# Altium schematic sheet Boost_Stage.SchDoc
size B
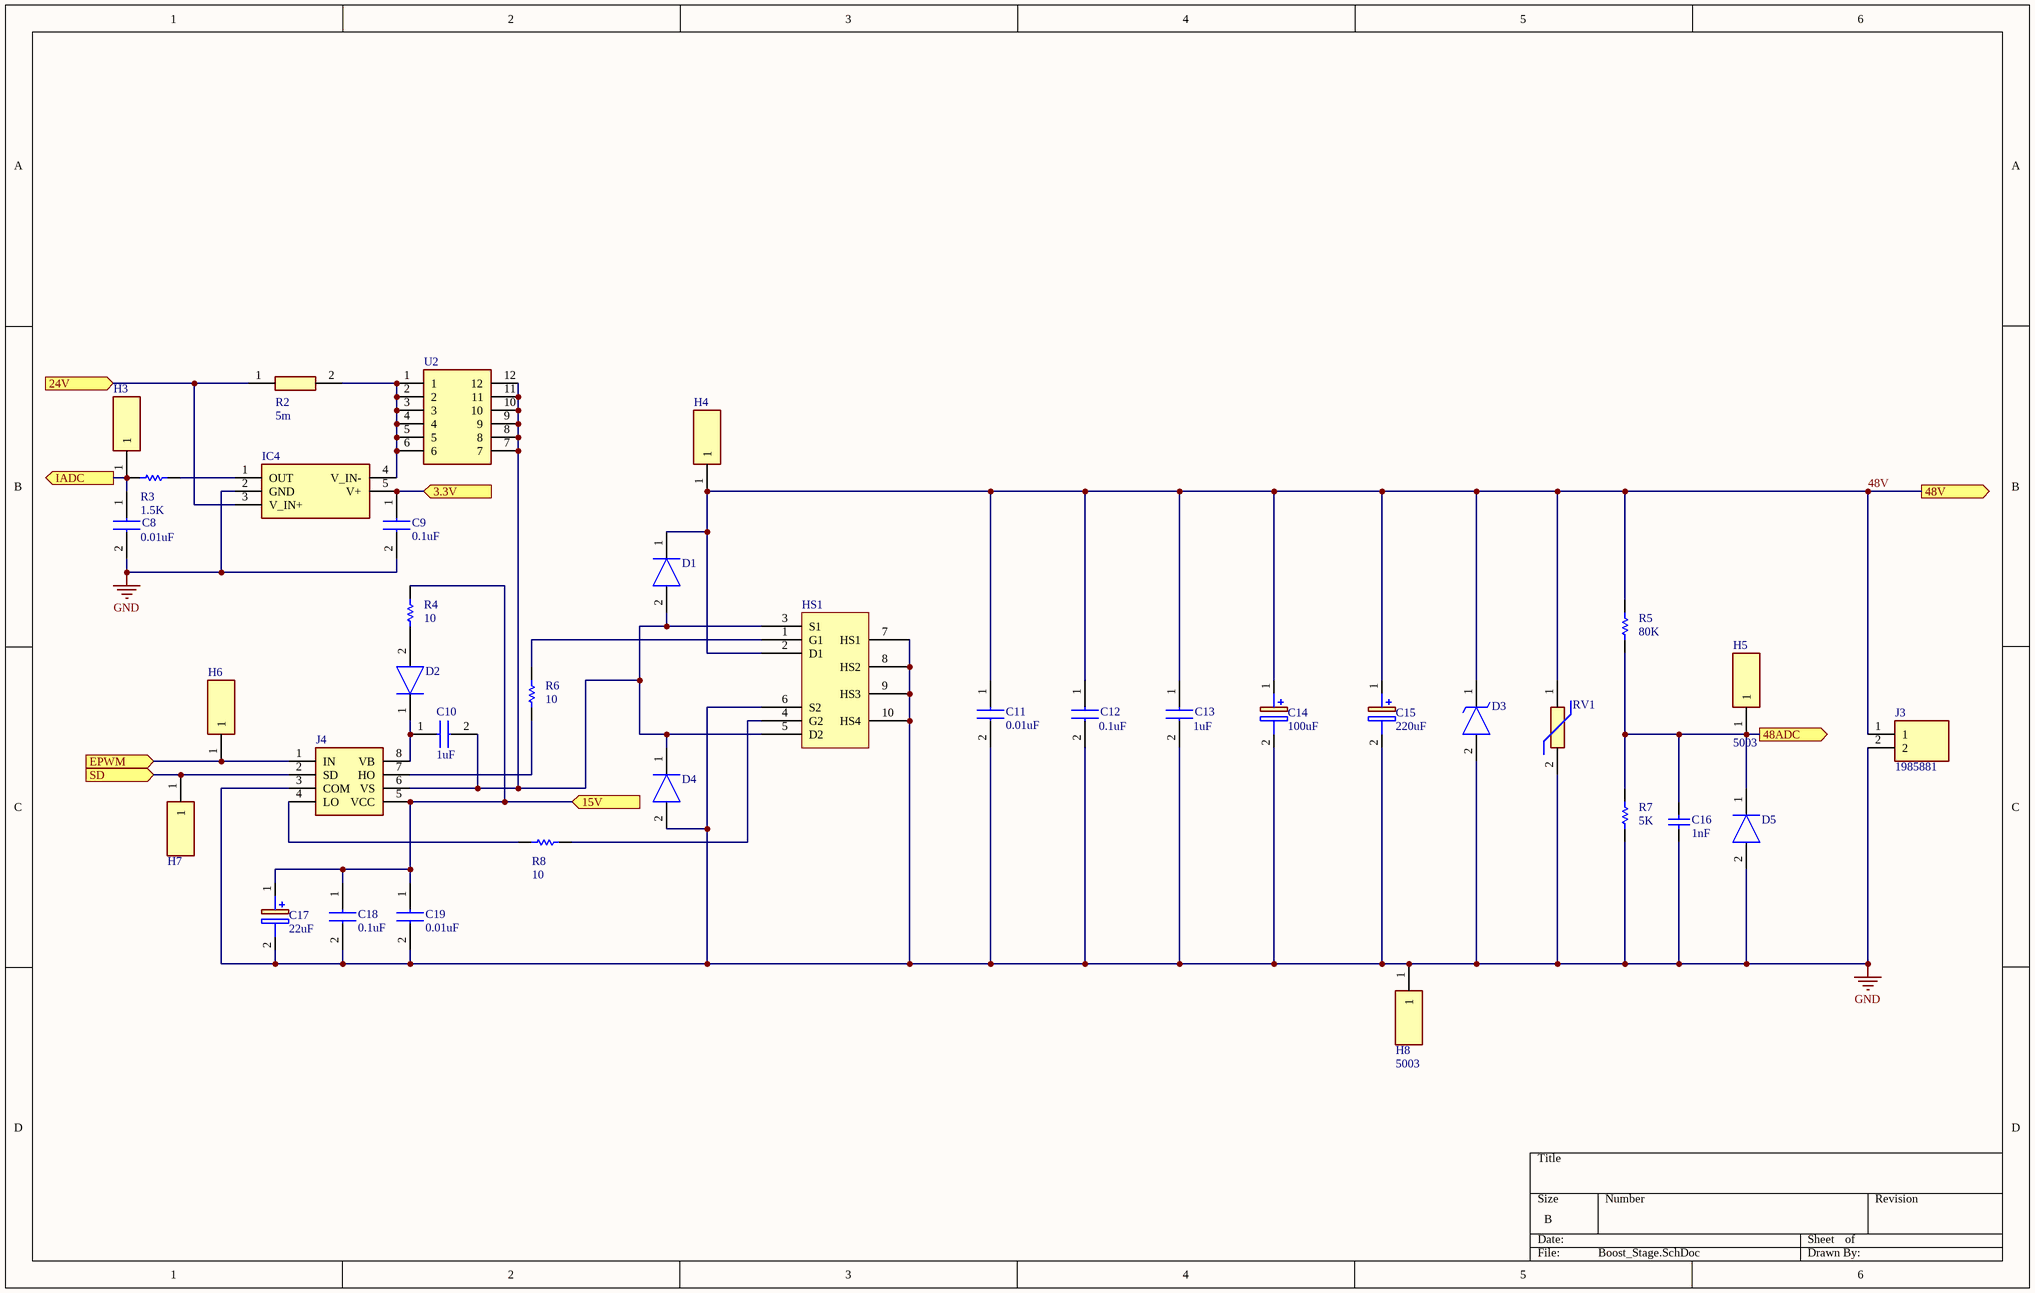
[diagram p0: Boost_Stage.SchDoc]

## Parts
C8  value 0.01uF  [C315C103K5R5TA7990]  (hidden comment: C315C103K5R5TA7990)
C9  value 0.1uF  [K104K10X7RF5UH5]  (hidden comment: K104K10X7RF5UH5)
C10  value 1uF  [RCE5C1H104J2A2H03B]  (hidden comment: RDER72A105K2M1H03A)
C11  value 0.01uF  [R82(7.2X2.5)]  (hidden comment: R82EC2100DQ50J)
C12  value 0.1uF  [ECQE2104JF]  (hidden comment: ECQ-E2104JF)
C13  value 1uF  [ECQE2105KF]  (hidden comment: ECQ-E2105KF)
C14  value 100uF  [CAPPRD500W65D1000H2200]  (hidden comment: EEU-FR2A101)
C15  value 220uF  [CAPPRD500W65D1250H2700]  (hidden comment: EEU-FS2A221)
C16  1nF  [CAPC2013X95X45NL10T25]
C17  value 22uF  [CAPPRD200W50D550H1250]  (hidden comment: UPW1E220MDD)
C18  value 0.1uF  [K104K10X7RF5UH5]  (hidden comment: K104K10X7RF5UH5)
C19  value 0.01uF  [C315C103K5R5TA7990]  (hidden comment: C315C103K5R5TA7990)
D1  S310FA  [SODFL3618X143N]  (value not drawn)
D2  1N4003  [DIOAD1413W86L463D238]  (value not drawn)
D3  P6KE91A-E3_54  [DIOAD1910W86L670D310]  (value not drawn)
D4  S310FA  [SODFL3618X143N]  (value not drawn)
D5  BZX584C3V3-G3-08  [SODFL1608X75N]  (value not drawn)
H3  5003  [5003]  (value not drawn)
H4  5003  [5003]  (value not drawn)
H5  5003  [5003]
H6  5003  [5003]  (value not drawn)
H7  5003  [5003]  (value not drawn)
H8  5003  [5003]
HS1  Dual Heatsink  [MOSFETsHeatsink]  (value not drawn)
IC4  INA194AIDBVR  [SOT95P280X145-5N]  (value not drawn)
J3  1985881  [SHDR2W110P0X500_1X2_1000X985X1390P]
J4  DILB8P-223TLF  [DIPS762W60P254L1016H525Q8N]  (value not drawn)
R2  5m  [CRE2512FZR005E3]
R3  value 1.5K  [AXIAL-0.3]  (hidden comment: Res1)
R4  value 10  [AXIAL-0.3]  (hidden comment: Res1)
R5  value 80K  [AXIAL-0.3]  (hidden comment: Res1)
R6  value 10  [AXIAL-0.3]  (hidden comment: Res1)
R7  value 5K  [AXIAL-0.3]  (hidden comment: Res1)
R8  value 10  [AXIAL-0.3]  (hidden comment: Res1)
RV1  V68ZS10P  [V68ZS10P]  (value not drawn)
U2  B65878E1012D001  [B65878E1012D001]  (value not drawn)

## Ports
3.3V (in), 15V (in), 24V (in), 48ADC (out), 48V (out), EPWM (in), IADC (out), SD (in)

## Nets
GND: C8.2 C9.2 C11.2 C12.2 C13.2 C14.2(-) C15.2(-) C16.1 C17.2(-) C18.2 C19.2 D3.2(A) D4.2(A) D5.2(A) H8.1 HS1.6(S2) HS1.7(HS1) HS1.8(HS2) HS1.9(HS3) HS1.10(HS4) IC4.2(GND) J3.2 J4.3(COM) R7.1 RV1.2
3.3V: C9.1 IC4.5(V+) ; port 3.3V
15V: C17.1(+) C18.1 C19.1 J4.5(VCC) R4.2 ; port 15V
24V: IC4.3(V_IN+) R2.1 ; port 24V
48ADC: C16.2 D5.1(K) H5.1 R5.1 R7.2 ; port 48ADC
48V: C11.1 C12.1 C13.1 C14.1(+) C15.1(+) D1.1(K) D3.1(K) H4.1 HS1.2(D1) J3.1 R5.2 RV1.1 ; port 48V
EPWM: H6.1 J4.1(IN) ; port EPWM
IADC: C8.1 H3.1 R3.2 ; port IADC
SD: H7.1 J4.2(SD) ; port SD
NetC10_1: C10.1 D2.1(K) J4.8(VB)
NetC10_2: C10.2 D1.2(A) D4.1(K) HS1.3(S1) HS1.5(D2) J4.6(VS) U2.7 U2.8 U2.9 U2.10 U2.11 U2.12
NetD2_2: D2.2(A) R4.1
NetHS1_1: HS1.1(G1) R6.2
NetHS1_4: HS1.4(G2) R8.1
NetIC4_1: IC4.1(OUT) R3.1
NetIC4_4: IC4.4(V_IN-) R2.2 U2.1 U2.2 U2.3 U2.4 U2.5 U2.6
NetJ4_4: J4.4(LO) R8.2
NetJ4_7: J4.7(HO) R6.1

## Library data of the parts
C8 C19 = C315C103K5R5TA7990: Capacitor 50V; Manufacturer_Name: Kemet; Datasheet Link: https://api.kemet.com/component-edge/download/datasheet/C315C103K5R5TA.pdf; Height: 4.66mm; Manufacturer_Part_Number: C315C103K5R5TA7990; Mouser Part Number: N/A; Mouser Price/Stock: https://www.mouser.com/Search/Refine.aspx?Keyword=N%2FA
C9 C18 = K104K10X7RF5UH5: Capacitor 50V; Manufacturer_Name: Vishay; Datasheet Link: https://www.vishay.com/docs/45171/kseries.pdf; Height: 6.2mm; Manufacturer_Part_Number: K104K10X7RF5UH5; Mouser Part Number: 594-K104K10X7RF5UH5; Mouser Price/Stock: https://www.mouser.com/Search/Refine.aspx?Keyword=594-K104K10X7RF5UH5
C10 = RDER72A105K2M1H03A: Capacitor; Manufacturer_Name: Murata Electronics; Datasheet Link: https://psearch.en.murata.com/capacitor/product/RDER72A105K2M1H03A.html; Height: 5.5mm; Manufacturer_Part_Number: RDER72A105K2M1H03A; Mouser Part Number: 81-RDER72A105K2M1H3A; Mouser Price/Stock: https://www.mouser.com/Search/Refine.aspx?Keyword=81-RDER72A105K2M1H3A; RS Part Number: 1504005; RS Price/Stock: http://uk.rs-online.com/web/p/products/1504005
C11 = R82EC2100DQ50J: Capacitor 100V; Manufacturer_Name: Kemet; Allied_Number: 70037796; Datasheet Link: http://docs-emea.rs-online.com/webdocs/1529/0900766b81529050.pdf; Manufacturer_Part_Number: R82EC2100DQ50J; Mouser Part Number: 80-R82EC2100DQ50J; Mouser Price/Stock: https://www.mouser.com/Search/Refine.aspx?Keyword=80-R82EC2100DQ50J; RS Part Number: 3121431P; RS Price/Stock: http://uk.rs-online.com/web/p/products/3121431P; Allied Price/Stock: https://www.alliedelec.com/kemet-r82ec2100dq50j/70037796/
C12 = ECQ-E2104JF: Capacitor 250V; Manufacturer_Name: Panasonic; Allied_Number: 70260012; Datasheet Link: http://industrial.panasonic.com/www-cgi/jvcr13pz.cgi?E+PZ+4+ABD0023+ECQE2104JF+8+WW; Height: 13.4mm; Manufacturer_Part_Number: ECQ-E2104JF; Mouser Part Number: 667-ECQ-E2104JF; Mouser Price/Stock: https://www.mouser.com/Search/Refine.aspx?Keyword=667-ECQ-E2104JF; Allied Price/Stock: https://www.alliedelec.com/panasonic-ecq-e2104jf/70260012/
C13 = ECQ-E2105KF: Capacitor 250V; Manufacturer_Name: Panasonic; Datasheet Link: https://industrial.panasonic.com/cdbs/www-data/pdf/RDI0000/ABD0000C179.pdf; Height: 15mm; Manufacturer_Part_Number: ECQ-E2105KF; Mouser Part Number: 667-ECQ-E2105KF; Mouser Price/Stock: https://www.mouser.com/Search/Refine.aspx?Keyword=667-ECQ-E2105KF
C14 = EEU-FR2A101: Capacitor Polarised 100V; Manufacturer_Name: Panasonic; Datasheet Link: https://industrial.panasonic.com/cdbs/www-data/pdf/RDF0000/ABA0000C1259.pdf; Height: 22mm; Manufacturer_Part_Number: EEU-FR2A101; Mouser Part Number: 667-EEU-FR2A101; Mouser Price/Stock: https://www.mouser.com/Search/Refine.aspx?Keyword=667-EEU-FR2A101
C15 = EEU-FS2A221: Capacitor Polarised 100V; Manufacturer_Name: Panasonic; Datasheet Link: https://industrial.panasonic.com/cdbs/www-data/pdf/RDF0000/ABA0000C1255.pdf; Height: 27mm; Manufacturer_Part_Number: EEU-FS2A221; Mouser Part Number: 667-EEU-FS2A221; Mouser Price/Stock: https://www.mouser.com/Search/Refine.aspx?Keyword=667-EEU-FS2A221
C16 = CMP-2007-00148-1: Part Number: GRM2195C2A102JA01D; Manufacturer: Murata
C17 = UPW1E220MDD: Capacitor Polarised  25V; Manufacturer_Name: Nichicon; Allied_Number: 70187288; Datasheet Link: http://nichicon-us.com/english/products/pdfs/e-upw.pdf; Height: 12.5mm; Manufacturer_Part_Number: UPW1E220MDD; Mouser Part Number: 647-UPW1E220MDD; Mouser Price/Stock: https://www.mouser.com/Search/Refine.aspx?Keyword=647-UPW1E220MDD; RS Part Number: 7152625P; RS Price/Stock: http://uk.rs-online.com/web/p/products/7152625P; Allied Price/Stock: https://www.alliedelec.com/nichicon-upw1e220mdd/70187288/
D1 D4 = S310FA: Diode; Manufacturer_Name: ON Semiconductor; Datasheet Link: https://eagle.componentsearchengine.com/Datasheets/2/S310FA.pdf; Height: 1.43mm; Manufacturer_Part_Number: S310FA; Mouser Part Number: 512-S310FA; Mouser Price/Stock: https://www.mouser.com/Search/Refine.aspx?Keyword=512-S310FA; RS Part Number: 1841470; RS Price/Stock: http://uk.rs-online.com/web/p/products/1841470
D2 = 1N4003: Diode; Manufacturer_Name: ON Semiconductor; Datasheet Link: http://docs-emea.rs-online.com/webdocs/10c0/0900766b810c07cd.pdf; Manufacturer_Part_Number: 1N4003; Mouser Part Number: 512-1N4003; Mouser Price/Stock: http://www.mouser.com/Search/ProductDetail.aspx?qs=PKwgOmPR8%252bn6tj%252bW%252bQZQFA%3d%3d; RS Part Number: 7596674P; RS Price/Stock: http://uk.rs-online.com/web/p/products/7596674P
D3 = P6KE91A-E3_54: TVS Diode (Uni-directional); Manufacturer_Name: Vishay; Manufacturer_Part_Number: P6KE91A-E3/54; Datasheet Link: https://www.mouser.com/datasheet/2/427/p6ke-1767850.pdf
D5 = BZX584C3V3-G3-08: Diode; Manufacturer_Name: Vishay; Datasheet Link: https://componentsearchengine.com/Datasheets/1/BZX584C3V3-G3-08.pdf; Height: 0.75mm; Manufacturer_Part_Number: BZX584C3V3-G3-08; Mouser Part Number: 78-BZX584C3V3-G3-08; Mouser Price/Stock: https://www.mouser.com/Search/Refine.aspx?Keyword=78-BZX584C3V3-G3-08
H3-H8 = 5003: Hardware; Manufacturer_Name: Keystone Electronics; Allied_Number: 70799414; Datasheet Link: https://componentsearchengine.com/Datasheets/1/5003.pdf; Height: 4.57mm; Manufacturer_Part_Number: 5003; Mouser Part Number: 534-5003; Mouser Price/Stock: https://www.mouser.com/Search/Refine.aspx?Keyword=534-5003; Allied Price/Stock: https://www.alliedelec.com/keystoneelectronics-5003/70799414/
HS1 = WV-DT2-101E_1: Heat Sink TO-220, TO-247 (Dual) Aluminum 4.0W @ 40°C Board Level, Vertical
IC4 = INA194AIDBVR: Integrated Circuit; Manufacturer_Name: Texas Instruments; Datasheet Link: http://www.ti.com/lit/gpn/ina194; Height: 1.45mm; Manufacturer_Part_Number: INA194AIDBVR; Mouser Part Number: 595-INA194AIDBVR; Mouser Price/Stock: https://www.mouser.com/Search/Refine.aspx?Keyword=595-INA194AIDBVR
J3 = 1985881: Connector; Manufacturer_Name: Phoenix Contact; Allied_Number: 70353630; Datasheet Link: https://www.phoenixcontact.com/online/portal/us?uri=pxc-oc-itemdetail:pid=1985881&library=usen&tab=1; Height: 13.9mm; Manufacturer_Part_Number: 1985881; Mouser Part Number: 651-1985881; Mouser Price/Stock: https://www.mouser.com/Search/Refine.aspx?Keyword=651-1985881; RS Part Number: 4670338; RS Price/Stock: http://uk.rs-online.com/web/p/products/4670338; Allied Price/Stock: https://www.alliedelec.com/phoenixcontact-1985881/70353630/
J4 = DILB8P-223TLF: Connector; Manufacturer_Name: Amphenol; Datasheet Link: https://componentsearchengine.com/Datasheets/1/DILB8P-223TLF.pdf; Height: 5.25mm; Mouser2 Part Number: 649-DILB8P223TLF; Mouser2 Price/Stock: https://www.mouser.com/Search/Refine.aspx?Keyword=649-DILB8P223TLF; Manufacturer_Part_Number: DILB8P-223TLF
R2 = CRE2512-FZ-R005E-3: 5mOhm Sensing Resistor CRE2512-FZ-R005E-3; Manufacturer_Name: Bourns; Allied_Number: 70418758; Datasheet Link: https://www.mouser.com/datasheet/2/54/re-1388683.pdf; Height: 0.7mm; Manufacturer_Part_Number: CRE2512-FZ-R005E-3; Mouser Part Number: 652-CRE2512FZR005E-3; Mouser Price/Stock: https://www.mouser.com/Search/Refine.aspx?Keyword=652-CRE2512FZR005E-3; RS Part Number: 1825562P; RS Price/Stock: http://uk.rs-online.com/web/p/products/1825562P; Allied Price/Stock: https://www.alliedelec.com/bourns-cre2512-fz-r005e-3/70418758/
R3-R8 = Res1: Resistor; Published: 8-Jun-2000; LatestRevisionDate: 17-Jul-2002; LatestRevisionNote: Re-released for DXP Platform.; PackageReference: AXIAL-0.3; Publisher: Altium Limited; PackageDescription: Axial Device, Thru-Hole; 2 Leads; 0.3 in Pin Spacing
RV1 = V68ZS10P: Varistor; Manufacturer_Name: LITTELFUSE; Datasheet Link: http://www.littelfuse.com/~/media/electronics/datasheets/varistors/littelfuse_varistor_za_datasheet.pdf.pdf; Height: 20mm; Manufacturer_Part_Number: V68ZS10P
U2 = B65878E1012D001: Undefined or Miscellaneous; Manufacturer_Name: EPCOS; Datasheet Link: http://www.mouser.com/datasheet/2/400/pq_26_25-1280911.pdf; Height: 29.3mm; Manufacturer_Part_Number: B65878E1012D001; Mouser Part Number: 871-B65878E1012D001; Mouser Price/Stock: https://www.mouser.com/Search/Refine.aspx?Keyword=871-B65878E1012D001; RS Part Number: 1253423; RS Price/Stock: http://uk.rs-online.com/web/p/products/1253423